# Altium schematic sheet CAN bus.SchDoc
size A4
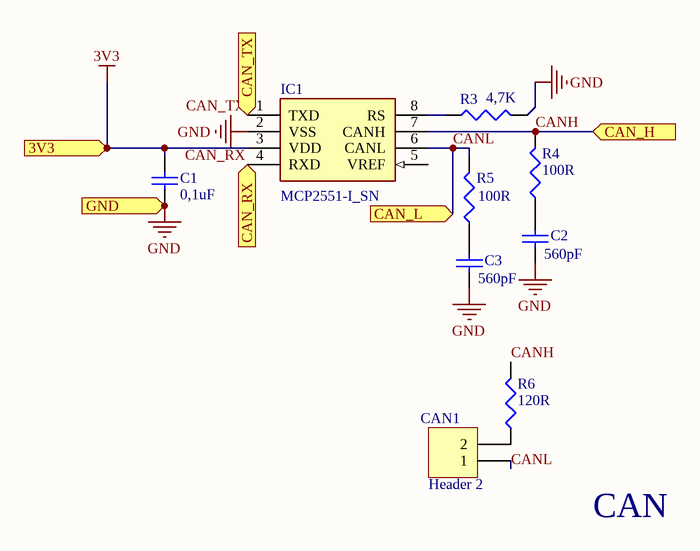
[diagram p0: CAN bus.SchDoc]

## Parts
C1  0,1uF  [1608[0603]]
C2  560pF  [1608[0603]]
C3  560pF  [1608[0603]]
CAN1  Header 2  [HDR1X2]
IC1  MCP2551-I_SN  [SOIC127P600X175-8N]
R3  4,7K  [J1-0603]
R4  100R  [J1-0603]
R5  100R  [J1-0603]
R6  120R  [J1-0603]

## Ports
3V3 (in), CAN_H (in), CAN_L (in), CAN_RX (in), CAN_TX (in), GND (in)

## Nets
3V3: C1.1 IC1.3(VDD) ; port 3V3
GND: C1.2 C2.2 C3.2 IC1.2(VSS) R3.2 ; port GND
CAN_RX: IC1.4(RXD) ; port CAN_RX
CAN_TX: IC1.1(TXD) ; port CAN_TX
CANH: IC1.7(CANH) R4.2 R6.2 ; port CAN_H
CANL: CAN1.1 IC1.6(CANL) R5.2 ; port CAN_L
NetC2_1: C2.1 R4.1
NetC3_1: C3.1 R5.1
NetCAN1_2: CAN1.2 R6.1
NetIC1_8: IC1.8(RS) R3.1

Not connected (* = marked no-connect by the designer): IC1 5(VREF)

## Notes on the sheet
- CAN

## Library data of the parts
C1-C3 = Cap Semi: Capacitor (Semiconductor SIM Model); Value: 100pF; Published: 8-Jun-2000; LatestRevisionDate: 29-May-2009; LatestRevisionNote: IPC-7351 Footprint Added.; PackageReference: C1206; Publisher: Altium Limited; PackageDescription: Chip Capacitor
CAN1 = Header 2: Header, 2-Pin; LatestRevisionDate: 17-Jul-2002; LatestRevisionNote: Re-released for DXP Platform.; Publisher: Altium Limited
IC1 = MCP2551-I_SN: Integrated Circuit; Manufacturer_Name: Microchip; Manufacturer_Part_Number: MCP2551-I/SN; Allied_Number: 70045403; Datasheet Link: http://docs-emea.rs-online.com/webdocs/0a78/0900766b80a78cdb.pdf; Height: 1.75mm; Mouser Part Number: 579-MCP2551-I/SN; Mouser Price/Stock: https://www.mouser.com/Search/Refine.aspx?Keyword=579-MCP2551-I%2FSN; RS Part Number: 0402904P; RS Price/Stock: http://uk.rs-online.com/web/p/products/0402904P; Allied Price/Stock: http://www.alliedelec.com/microchip-technology-inc-mcp2551-i-sn/70045403/
R3-R6 = Res3: Resistor; Value: 3,3k; Published: 8-Jun-2000; LatestRevisionDate: 29-May-2009; LatestRevisionNote: IPC-7351 Footprint Added.; PackageReference: J1-0603; Publisher: Altium Limited; PackageDescription: Chip Resistor